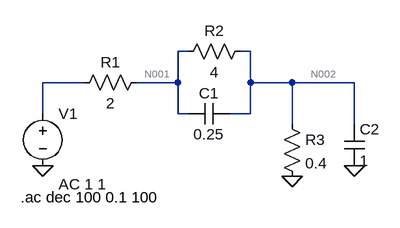
[diagram p0: schematic Ej2.asc]
Ej2.asc, the LTspice schematic file:
Version 4
SHEET 1 880 680
WIRE 128 64 112 64
WIRE 224 64 208 64
WIRE -32 112 -96 112
WIRE 112 112 112 64
WIRE 112 112 48 112
WIRE 224 112 224 64
WIRE 288 112 224 112
WIRE 384 112 288 112
WIRE -96 160 -96 112
WIRE 112 160 112 112
WIRE 128 160 112 160
WIRE 224 160 224 112
WIRE 224 160 192 160
WIRE 288 176 288 112
WIRE 384 176 384 112
FLAG -96 240 0
FLAG 288 256 0
FLAG 384 240 0
SYMBOL res 64 96 R90
WINDOW 0 0 56 VBottom 2
WINDOW 3 32 56 VTop 2
SYMATTR InstName R1
SYMATTR Value 2
SYMBOL res 224 48 R90
WINDOW 0 0 56 VBottom 2
WINDOW 3 32 56 VTop 2
SYMATTR InstName R2
SYMATTR Value 4
SYMBOL cap 192 144 R90
WINDOW 0 0 32 VBottom 2
WINDOW 3 32 32 VTop 2
SYMATTR InstName C1
SYMATTR Value 0.25
SYMBOL res 272 160 R0
SYMATTR InstName R3
SYMATTR Value 0.4
SYMBOL cap 368 176 R0
SYMATTR InstName C2
SYMATTR Value 1
SYMBOL voltage -96 144 R0
WINDOW 123 24 124 Left 2
WINDOW 39 0 0 Left 0
SYMATTR InstName V1
SYMATTR Value ""
SYMATTR Value2 AC 1 1
TEXT -130 288 Left 2 !.ac dec 100 0.1 100

The netlist it stands for:
* Ej2.asc
R1 N001 N003 2
R2 N002 N001 4
C1 N002 N001 0.25
R3 N002 0 0.4
C2 N002 0 1
V1 N003 0 AC 1 1
.ac dec 100 0.1 100
.backanno
.end

* Results of the author's LTspice run, read from the files saved beside the schematic
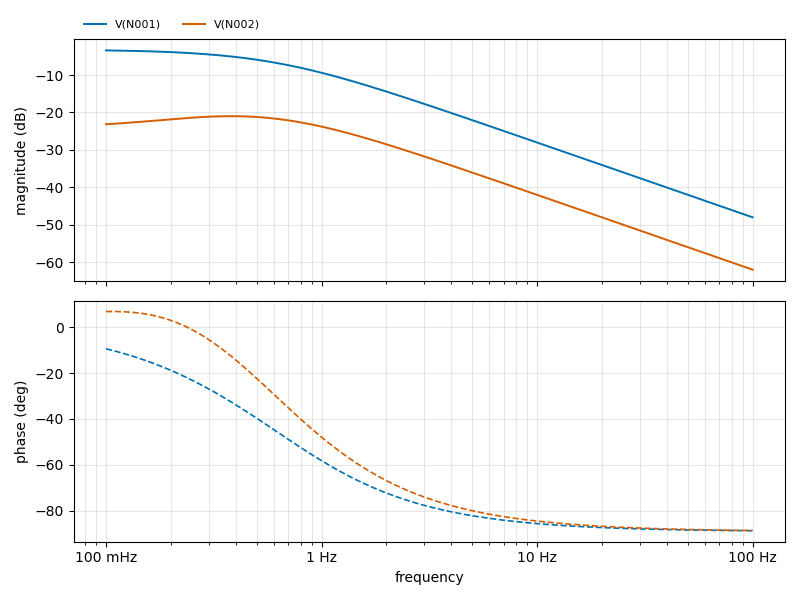
[diagram p1: AC Analysis of Ej2.asc, plotted from the saved traces]
* AC Analysis, 1 run:
*   V(N001): -3.43 dB at 100 mHz, -48.00 dB at 100 Hz, peak -3.43 dB at 100 mHz, 3 dB below the peak at 571.5 mHz
*   V(N002): -23.15 dB at 100 mHz, -61.98 dB at 100 Hz, peak -20.99 dB at 380.2 mHz, 3 dB below the peak at 1.041 Hz